# EAGLE design olhos_5V_conectado (EAGLE 9.6.2)
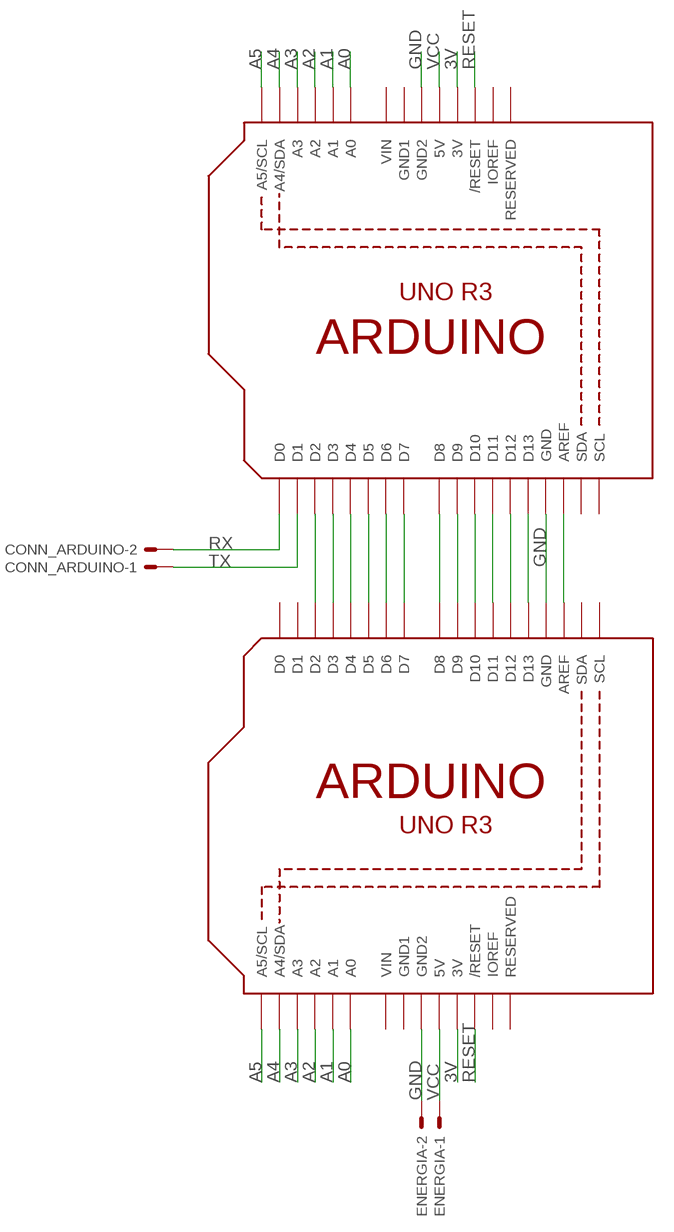
[diagram p0: schematic, sheet 1]

## Parts
CONN_ARDUINO  22-23-2021  [22-23-2021]
ENERGIA  22-23-2021  [22-23-2021]
TELA_LCD  ARDUINOR3-BPLACE  [ARDUINOR3-BPLACE]
U2  ARDUINOR3-BPLACE  [ARDUINOR3-BPLACE]

## Nets
3V [ENERGIA]: TELA_LCD.3V U2.3V
A0: TELA_LCD.A0 U2.A0
A1: TELA_LCD.A1 U2.A1
A2: TELA_LCD.A2 U2.A2
A3: TELA_LCD.A3 U2.A3
A4: TELA_LCD.A4(A4/SDA) U2.A4(A4/SDA)
A5: TELA_LCD.A5(A5/SCL) U2.A5(A5/SCL)
GND [ENERGIA]: ENERGIA.2 TELA_LCD.GND TELA_LCD.GND2 U2.GND U2.GND2
N$1: TELA_LCD.D2 U2.D2
N$2: TELA_LCD.D3 U2.D3
N$3: TELA_LCD.D4 U2.D4
N$4: TELA_LCD.D5 U2.D5
N$5: TELA_LCD.D6 U2.D6
N$6: TELA_LCD.D7 U2.D7
N$7: TELA_LCD.D8 U2.D8
N$8: TELA_LCD.D9 U2.D9
N$9: TELA_LCD.D10 U2.D10
N$10: TELA_LCD.D11 U2.D11
N$11: TELA_LCD.D12 U2.D12
N$12: TELA_LCD.D13 U2.D13
N$14: TELA_LCD.AREF U2.AREF
RESET: TELA_LCD.RESET(/RESET) U2.RESET(/RESET)
RX: CONN_ARDUINO.2 U2.D0
TX: CONN_ARDUINO.1 U2.D1
VCC [ENERGIA]: ENERGIA.1 TELA_LCD.5V U2.5V
Unconnected: TELA_LCD.D0 TELA_LCD.D1 TELA_LCD.IOREF TELA_LCD.RESERVED TELA_LCD.SCL TELA_LCD.SDA U2.IOREF U2.RESERVED U2.SCL U2.SDA

## Power pins joined to a net without a drawn wire
GND1: TELA_LCD.GND1 U2.GND1
VIN: TELA_LCD.VIN U2.VIN

## Library data of the parts
CONN_ARDUINO ENERGIA = con-molex:22-23-2021: .100" (2.54mm) Center Header - 2 Pin; MF: MOLEX; MPN: 22-23-2021; OC_FARNELL: 1462926; OC_NEWARK: 25C3832
TELA_LCD U2 = adafruit:ARDUINOR3: This is a new object for the new Arduino R3 - with extra pins that you may want to use (such as IOref, and duplicated A4/A5

## Net classes
0 default: width 0.508 mm, clearance 0.5 mm
1 ENERGIA: width 1.016 mm, clearance 0.5 mm

## Board
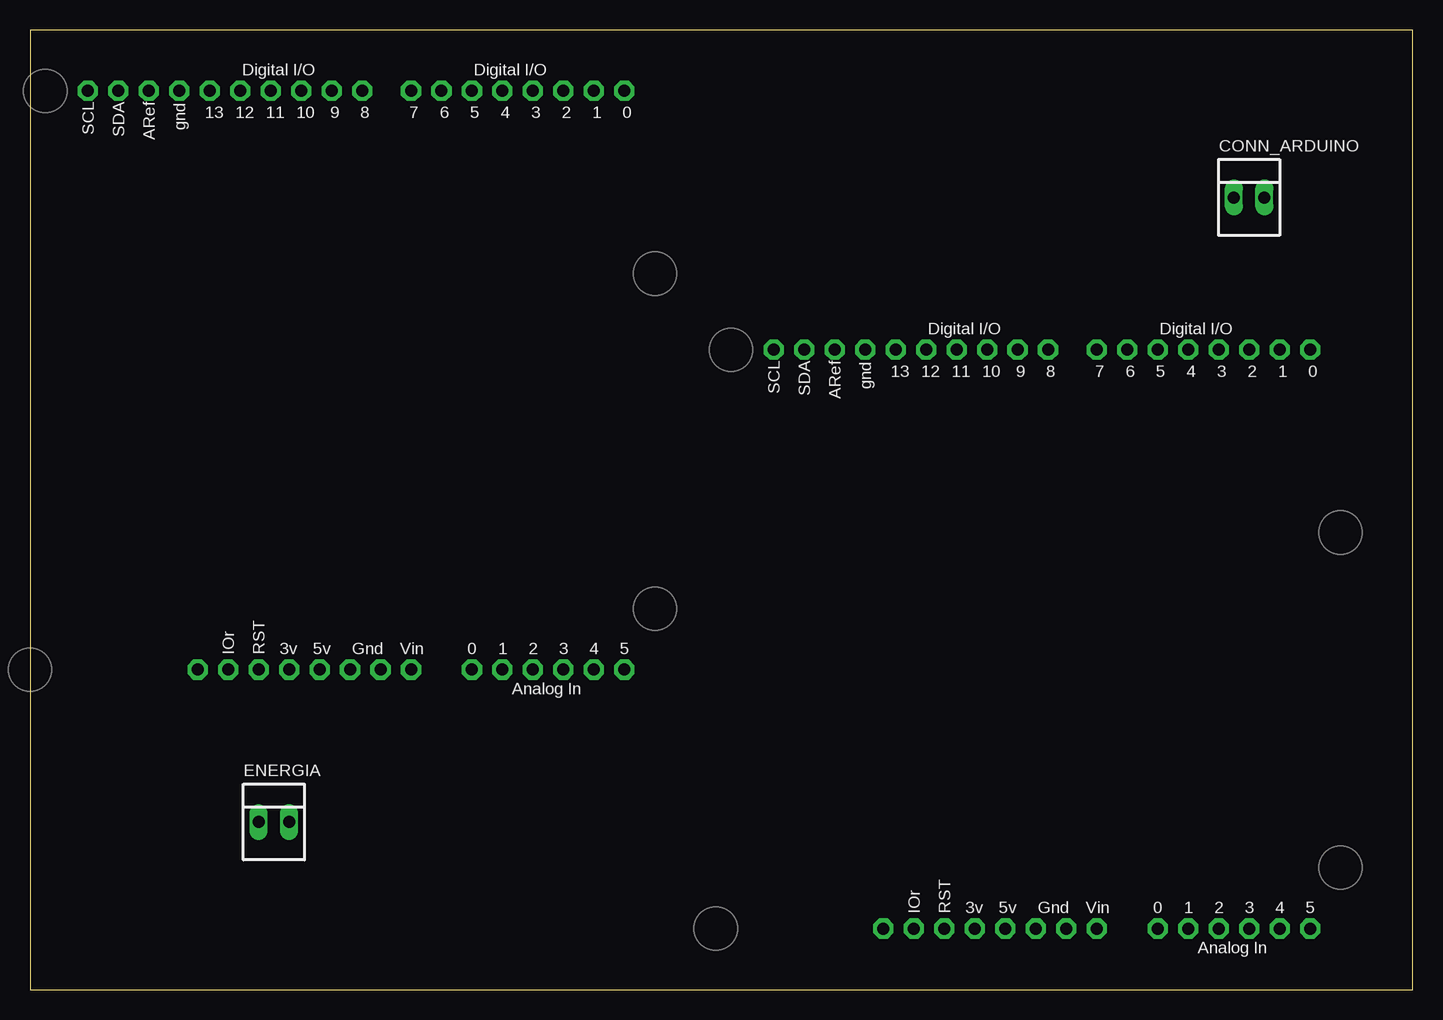
[diagram p1: board, top side]
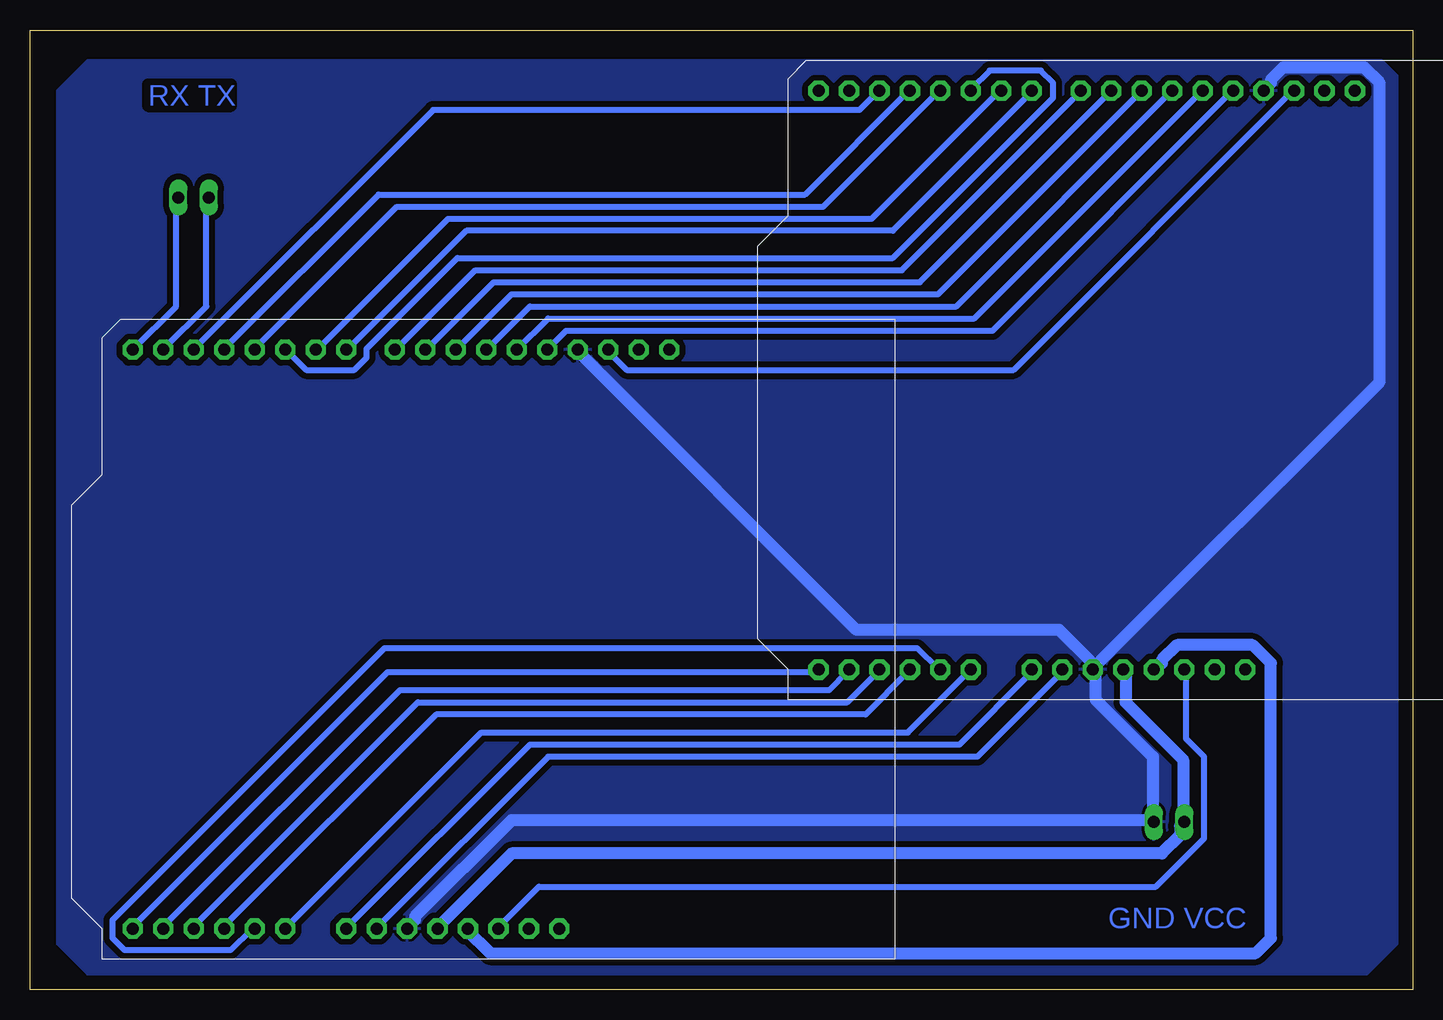
[diagram p2: board, bottom side, seen from below]

Size 115.24 x 80 mm. Coordinates in mm from the lower left corner, seen from the top.
Outline: 0,0 115.24,0 115.24,80 0,80 0,0
Copper layers (1*16): Top 0.035mm / dielectric 1.5mm / Bottom 0.035mm
Design rules "default": minimum track width 6mil, minimum drill 0.35mm, track to track 6mil, track to pad 6mil, pad to pad 6mil, via to via 6mil, smd to smd 6mil, copper to edge 40mil, drill to drill 6mil, minimum pad ring 10mil, minimum via ring 8mil, stop-mask expansion 4mil, vias tented up to drill 0mil, thermal gap 10mil

### Footprints (pad centres in the part's own frame; a part is rotated, then mirrored left to right if it is on the bottom)
22-23-2021 = drill 1 long: 1 -1.27,0; 2 1.27,0
ARDUINOR3-BPLACE = drill 1 pad 1.676 octagon: 3V 35.56,2.54; 5V 38.1,2.54; A0 50.8,2.54; A1 53.34,2.54; A2 55.88,2.54; A3 58.42,2.54; A4 60.96,2.54; A5 63.5,2.54; AREF 23.876,50.8; D0 63.5,50.8; D1 60.96,50.8; D2 58.42,50.8; D3 55.88,50.8; D4 53.34,50.8; D5 50.8,50.8; D6 48.26,50.8; D7 45.72,50.8; D8 41.656,50.8; D9 39.116,50.8; D10 36.576,50.8; D11 34.036,50.8; D12 31.496,50.8; D13 28.956,50.8; GND 26.416,50.8; GND1 43.18,2.54; GND2 40.64,2.54; IOREF 30.48,2.54; RESERVED 27.94,2.54; RESET 33.02,2.54; SCL 18.796,50.8; SDA 21.336,50.8; VIN 45.72,2.54

### Placement (x,y rotation side)
CONN_ARDUINO  101.6,66.04 0 top
ENERGIA  20.32,13.97 0 top
TELA_LCD  -13.97,24.13 0 top
U2  43.18,2.54 0 top

### Tracks (layer width: path | path; a pad name or v marks a point on that pad's centre or on a via)
3V
  Bottom 1.016: TELA_LCD.3V 21.42,26.71 20.92,27.22 20.92,27.47 19.66,28.73 13.36,28.73 11.84,27.22 11.84,4.28 13.1,3.02 76.86,3.02 78.88,5.04 U2.3V
A0
  Bottom 0.508: TELA_LCD.A0 37.04,26.46 42.08,21.42 77.62,21.42 93.74,5.29 U2.A0
A1
  Bottom 0.508: TELA_LCD.A1 39.56,26.71 41.33,28.48 85.68,28.48 108.36,5.8 108.36,4.28 107.35,3.28 98.53,3.28 96.77,5.04 U2.A1
A2
  Bottom 0.508: U2.A2 99.04,5.29 81.4,22.93 45.61,22.93 42.08,26.46 TELA_LCD.A2
A3
  Bottom 0.508: TELA_LCD.A3 44.6,26.46 47.12,23.94 82.91,23.94 101.56,5.29 U2.A3
A4
  Bottom 0.508: U2.A4 104.08,5.29 84.42,24.95 48.64,24.95 47.12,26.46 TELA_LCD.A4
A5
  Bottom 0.508: TELA_LCD.A5 49.64,26.46 85.43,26.46 106.6,5.29 U2.A5
GND
  Bottom 1.016: TELA_LCD.GND2 26.46,26.46 26.46,24.19 21.67,19.4 21.67,14.11 ENERGIA.2 22.18,14.11 75.1,14.11 83.16,6.05 83.16,5.8 83.66,5.29 U2.GND2 | TELA_LCD.GND 12.35,75.1 11.84,75.6 11.84,75.85 10.84,76.86 4.03,76.86 2.77,75.6 2.77,50.65 26.46,26.96 TELA_LCD.GND2 | U2.GND 69.55,53.17 46.37,29.99 29.48,29.99 26.71,27.22 TELA_LCD.GND2
  pour Bottom: 2.54,77.47 110.49,77.47 113.03,74.93 113.03,3.81 110.49,1.27 3.81,1.27 2.54,2.54 1.27,3.81 1.27,76.2
GND1
  Bottom 0.508: U2.GND1 86.18,5.29 72.07,19.4 36.29,19.4 29.23,26.46 TELA_LCD.GND1
N$1
  Bottom 0.508: U2.D2 101.56,53.42 81.65,73.33 46.12,73.33 44.6,74.84 TELA_LCD.D2
N$2
  Bottom 0.508: TELA_LCD.D3 42.08,74.84 50.65,66.28 86.18,66.28 99.04,53.42 U2.D3
N$3
  Bottom 0.508: TELA_LCD.D4 39.56,74.84 49.14,65.27 84.67,65.27 96.52,53.42 U2.D4
N$4
  Bottom 0.508: TELA_LCD.D5 36.79,75.1 35.28,76.61 31,76.61 29.99,75.6 29.99,74.34 43.34,60.98 79.63,60.98 87.19,53.42 87.19,52.67 88.2,51.66 92.23,51.66 93.74,53.17 U2.D5
N$5
  Bottom 0.508: TELA_LCD.D6 34.52,74.84 45.11,64.26 80.39,64.26 91.22,53.42 U2.D6
N$6
  Bottom 0.508: U2.D7 88.7,53.42 78.88,63.25 43.34,63.25 31.75,74.84 TELA_LCD.D7
N$7
  Bottom 0.508: TELA_LCD.D8 27.72,74.84 42.59,59.98 78.12,59.98 84.67,53.42 U2.D8
N$8
  Bottom 0.508: TELA_LCD.D9 25.2,74.84 41.08,58.97 76.61,58.97 82.15,53.42 U2.D9
N$9
  Bottom 0.508: TELA_LCD.D10 22.68,74.84 39.56,57.96 75.1,57.96 79.63,53.42 U2.D10
N$10
  Bottom 0.508: TELA_LCD.D11 20.16,74.84 38.05,56.95 73.58,56.95 77.11,53.42 U2.D11
N$11
  Bottom 0.508: U2.D12 72.07,55.94 36.54,55.94 17.64,74.84 TELA_LCD.D12
N$12
  Bottom 0.508: TELA_LCD.D13 15.12,74.84 35.03,54.94 70.56,54.94 72.07,53.42 U2.D13
N$14
  Bottom 0.508: TELA_LCD.AREF 10.08,74.84 33.26,51.66 65.52,51.66 67.03,53.17 U2.AREF
RESET
  Bottom 0.508: TELA_LCD.RESET 18.9,26.46 18.9,20.92 17.39,19.4 17.39,12.6 21.42,8.57 72.83,8.57 76.1,5.29 U2.RESET
RX
  Bottom 0.508: U2.D0 103.07,56.95 103.07,66.02 CONN_ARDUINO.2
TX
  Bottom 0.508: CONN_ARDUINO.1 100.55,66.02 100.55,56.95 104.08,53.42 U2.D1
VCC
  Bottom 1.016: TELA_LCD.5V 23.94,26.46 23.94,23.94 19.15,19.15 19.15,14.11 ENERGIA.1 19.4,13.61 19.4,12.85 20.92,11.34 75.1,11.34 81.14,5.29 U2.5V
VIN
  Bottom 0.508: U2.VIN 88.7,5.29 73.58,20.41 37.8,20.41 31.75,26.46 TELA_LCD.VIN

### Text on the board
Bottom: RX TX | GND VCC